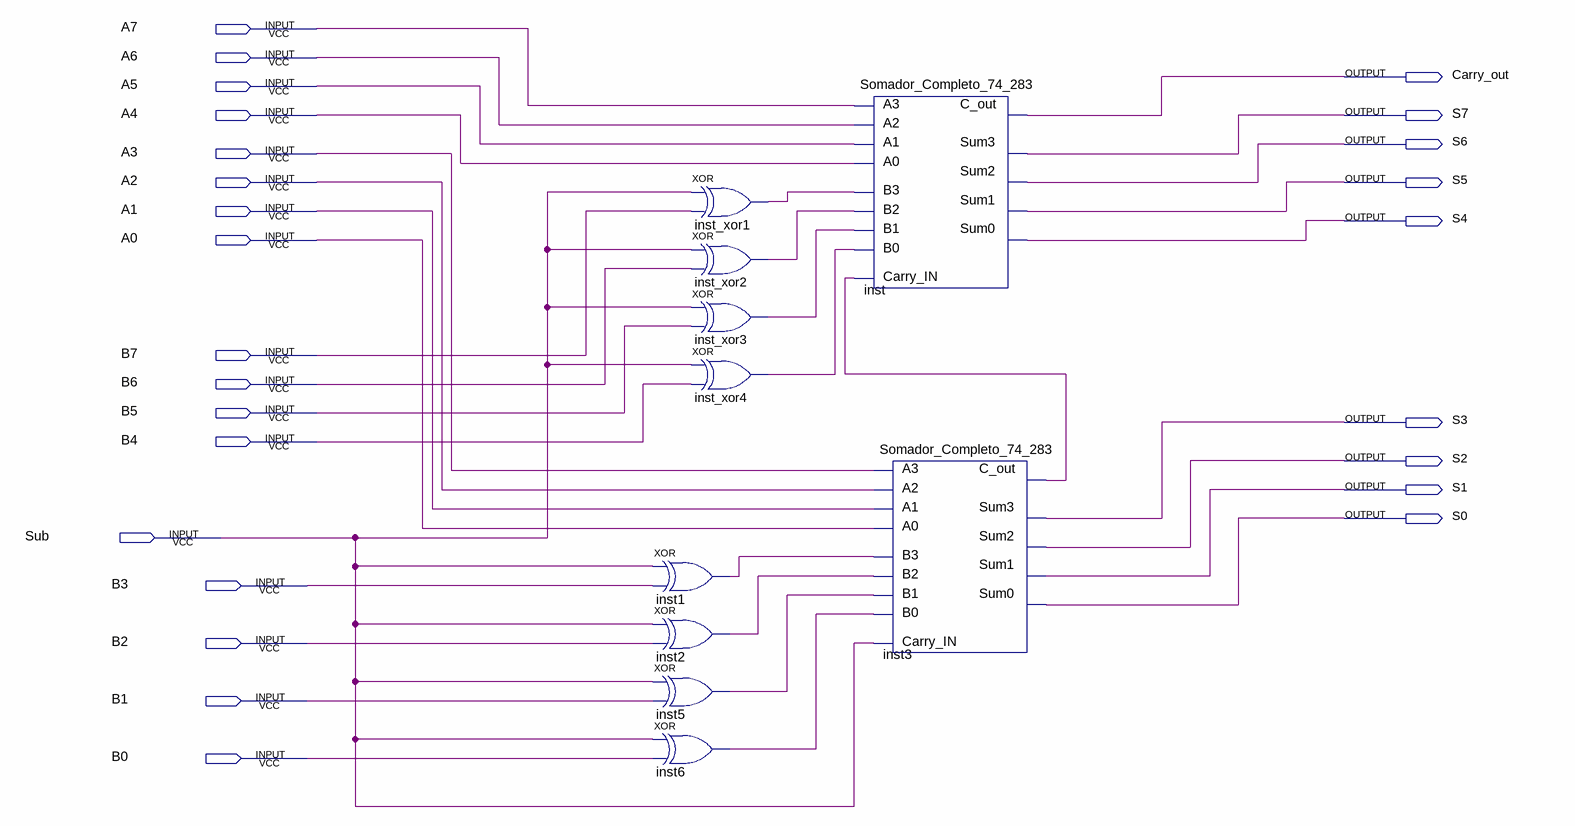
[diagram p0: schematic sheet]
// Quartus schematic SomadorSubtrator.bdf as structural Verilog: 10 symbols, 26 pins
module SomadorSubtrator (
  input  A7,
  input  A6,
  input  A5,
  input  A4,
  input  A3,
  input  A2,
  input  A1,
  input  A0,
  input  B7,
  input  B6,
  input  B5,
  input  B4,
  input  Sub,
  input  B3,
  input  B2,
  input  B1,
  input  B0,
  output Carry_out,
  output S7,
  output S6,
  output S5,
  output S4,
  output S3,
  output S2,
  output S1,
  output S0
);

  wire inst1_out, inst2_out, inst3_c_out, inst5_out, inst6_out, inst_xor1_out, inst_xor2_out, inst_xor3_out,
       inst_xor4_out;

  xor inst1 (inst1_out, Sub, B3);
  xor inst2 (inst2_out, Sub, B2);
  xor inst5 (inst5_out, Sub, B1);
  xor inst6 (inst6_out, Sub, B0);
  xor inst_xor1 (inst_xor1_out, Sub, B7);
  xor inst_xor2 (inst_xor2_out, Sub, B6);
  xor inst_xor3 (inst_xor3_out, Sub, B5);
  xor inst_xor4 (inst_xor4_out, Sub, B4);
  Somador_Completo_74_283 inst (
    .B3(inst_xor1_out), .A3(A7), .B2(inst_xor2_out), .A2(A6), .B1(inst_xor3_out), .A1(A5),
    .B0(inst_xor4_out), .A0(A4), .Carry_IN(inst3_c_out), .C_out(Carry_out), .Sum3(S7), .Sum2(S6), .Sum0(S4),
    .Sum1(S5));
  Somador_Completo_74_283 inst3 (
    .B3(inst1_out), .A3(A3), .B2(inst2_out), .A2(A2), .B1(inst5_out), .A1(A1), .B0(inst6_out), .A0(A0),
    .Carry_IN(Sub), .C_out(inst3_c_out), .Sum3(S3), .Sum2(S2), .Sum0(S0), .Sum1(S1));
endmodule
